# EAGLE design pwm-driver (EAGLE 4.16)
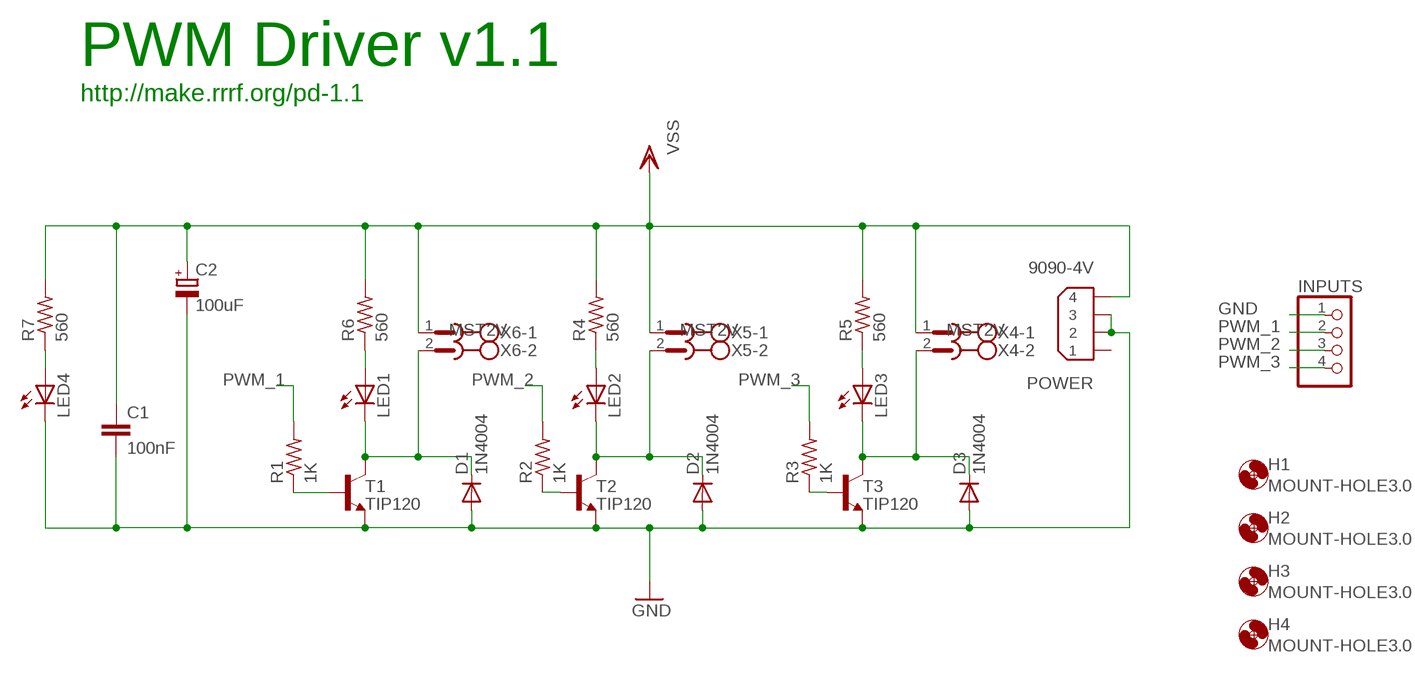
[diagram p0: schematic, sheet 1]

## Parts
C1  100nF  C-EU050-045X075  [C050-045X075]
C2  100uF  CPOL-EUE3.5-8  [E3,5-8]
D1  1N4004  [DO41-10]
D2  1N4004  [DO41-10]
D3  1N4004  [DO41-10]
H1  MOUNT-HOLE3.0  [3,0]
H2  MOUNT-HOLE3.0  [3,0]
H3  MOUNT-HOLE3.0  [3,0]
H4  MOUNT-HOLE3.0  [3,0]
INPUTS  PINHD-1X4  [1X04]
LED1  LED5MM  [LED5MM]
LED2  LED5MM  [LED5MM]
LED3  LED5MM  [LED5MM]
LED4  LED5MM  [LED5MM]
POWER  9090-4V  [9090-4V]
R1  1K  R-US_0207/7  [0207/7]
R2  1K  R-US_0207/7  [0207/7]
R3  1K  R-US_0207/7  [0207/7]
R4  560  R-US_0207/7  [0207/7]
R5  560  R-US_0207/7  [0207/7]
R6  560  R-US_0207/7  [0207/7]
R7  560  R-US_0207/7  [0207/7]
T1  TIP120  -NPN-TO220V  [TO220V]
T2  TIP120  -NPN-TO220V  [TO220V]
T3  TIP120  -NPN-TO220V  [TO220V]
X4  MST2V  [MSTBV2]
X5  MST2V  [MSTBV2]
X6  MST2V  [MSTBV2]

## Nets
GND: C1.2 C2.- D1.A D2.A D3.A INPUTS.1 LED4.K(C) POWER.2 POWER.3 T1.3(E) T2.3(E) T3.3(E)
N$1: D1.C LED1.K(C) T1.2(C) X6.2
N$2: D2.C LED2.K(C) T2.2(C) X5.2
N$3: D3.C LED3.K(C) T3.2(C) X4.2
N$4 [signal]: LED3.A R5.1
N$5 [signal]: LED2.A R4.1
N$6: R2.1 T2.1(B)
N$7: R3.1 T3.1(B)
N$8: R1.1 T1.1(B)
N$9 [signal]: LED1.A R6.1
N$10 [signal]: LED4.A R7.1
PWM_1 [signal]: INPUTS.2 R1.2
PWM_2 [signal]: INPUTS.3 R2.2
PWM_3 [signal]: INPUTS.4 R3.2
VSS: C1.1 C2.+ POWER.4 R4.2 R5.2 R6.2 R7.2 X4.1 X5.1 X6.1
Unconnected: POWER.1

## Notes on the sheet
- PWM Driver v1.1
- http://make.rrrf.org/pd-1.1

## Library data of the parts
C1 = rcl:C-EU: CAPACITOR, European symbol
C2 = rcl:CPOL-EU: POLARIZED CAPACITOR, European symbol
D1-D3 = diode:1N4004: DIODE general purpose rectifier, 1 A
H1-H4 = holes:MOUNT-HOLE: MOUNTING HOLE with drill center marker
INPUTS = pinhead:PINHD-1X4: PIN HEADER
LED1-LED4 = led:LED: LED OSRAM: - CHIPLED LG R971, LG N971, LY N971, LG Q971, LY Q971, LO R971, LY R971 LH N974, LH R974 LS Q976, LO Q976, LY Q976 LO Q996 - Hyper CHIPLED LW Q18S LB Q993, LB Q99A, LB R99A - SideLED LS A670, LO A670, LY A670, LG A670, LP A670 LB A673, LV A673, LT A673, LW A673 LH A674 LY A675 LS A676, LA A676, LO A676, LY A676, LW A676 LS A679, LY A679, LG A679 - Hyper Micro SIDELED® LS Y876, LA Y876, LO Y876, LY Y876 LT Y87S - SmartLED LW L88C, LW L88S LB L89C, LB L89S, LG L890 LS L89K, LO L89K, LY L89K LS L896, LA L896, LO L896, LY L896 - TOPLED LS T670, LO T670, LY T670, LG T670, LP T670 LSG T670, LSP T670, LSY T670, LOP T670, LYG T670 LG T671, LOG T671, LSG T671 LB T673, LV T673, LT T673, LW T673 LH T674 LS T676, LA T676, LO T676, LY T676, LB T676, LH T676, LSB T676, LW T676 LB T67C, LV T67C, LT T67C, LS T67K, LO T67K, LY T67K, LW E67C LS E67B, LA E67B, LO E67B, LY E67B, LB E67C, LV E67C, LT E67C LW T67C LS T679, LY T679, LG T679 LS T770, LO T770, LY T770, LG T770, LP T770 LB T773, LV T773, LT T773, LW T773 LH T774 LS E675, LA E675, LY E675, LS T675 LS T776, LA T776, LO T776, LY T776, LB T776 LHGB T686 LT T68C, LB T68C - Hyper Mini TOPLED® LB M676 - Mini TOPLED Santana® LG M470 LS M47K, LO M47K, LY M47K Source: http://www.osram.convergy.de - LUMILED® LXK2-PW12-R00, LXK2-PW12-S00, LXK2-PW14-U00, LXK2-PW14-V00 LXK2-PM12-R00, LXK2-PM12-S00, LXK2-PM14-U00 LXK2-PE12-Q00, LXK2-PE12-R00, LXK2-PE12-S00, LXK2-PE14-T00, LXK2-PE14-U00 LXK2-PB12-K00, LXK2-PB12-L00, LXK2-PB12-M00, LXK2-PB14-N00, LXK2-PB14-P00, LXK2-PB14-Q00 LXK2-PR12-L00, LXK2-PR12-M00, LXK2-PR14-Q00, LXK2-PR14-R00 LXK2-PD12-Q00, LXK2-PD12-R00, LXK2-PD12-S00 LXK2-PH12-R00, LXK2-PH12-S00 LXK2-PL12-P00, LXK2-PL12-Q00, LXK2-PL12-R00 Source: www.luxeon.com
POWER = con-thomas-betts:9090-4: Disk Drive Power four position Source: Thomas & Betts Electronic Interconnects Eiropean Edition 1998
R1-R7 = rcl:R-US_: RESISTOR, American symbol
T1-T3 = transistor:*-NPN-: NPN Transistror
X4-X6 = con-phoenix-508:MST2V: PHOENIX

## Net classes
0 default: width 1.27 mm, drill 0.406 mm
1 signal: width 0.508 mm, drill 0.406 mm

## Board
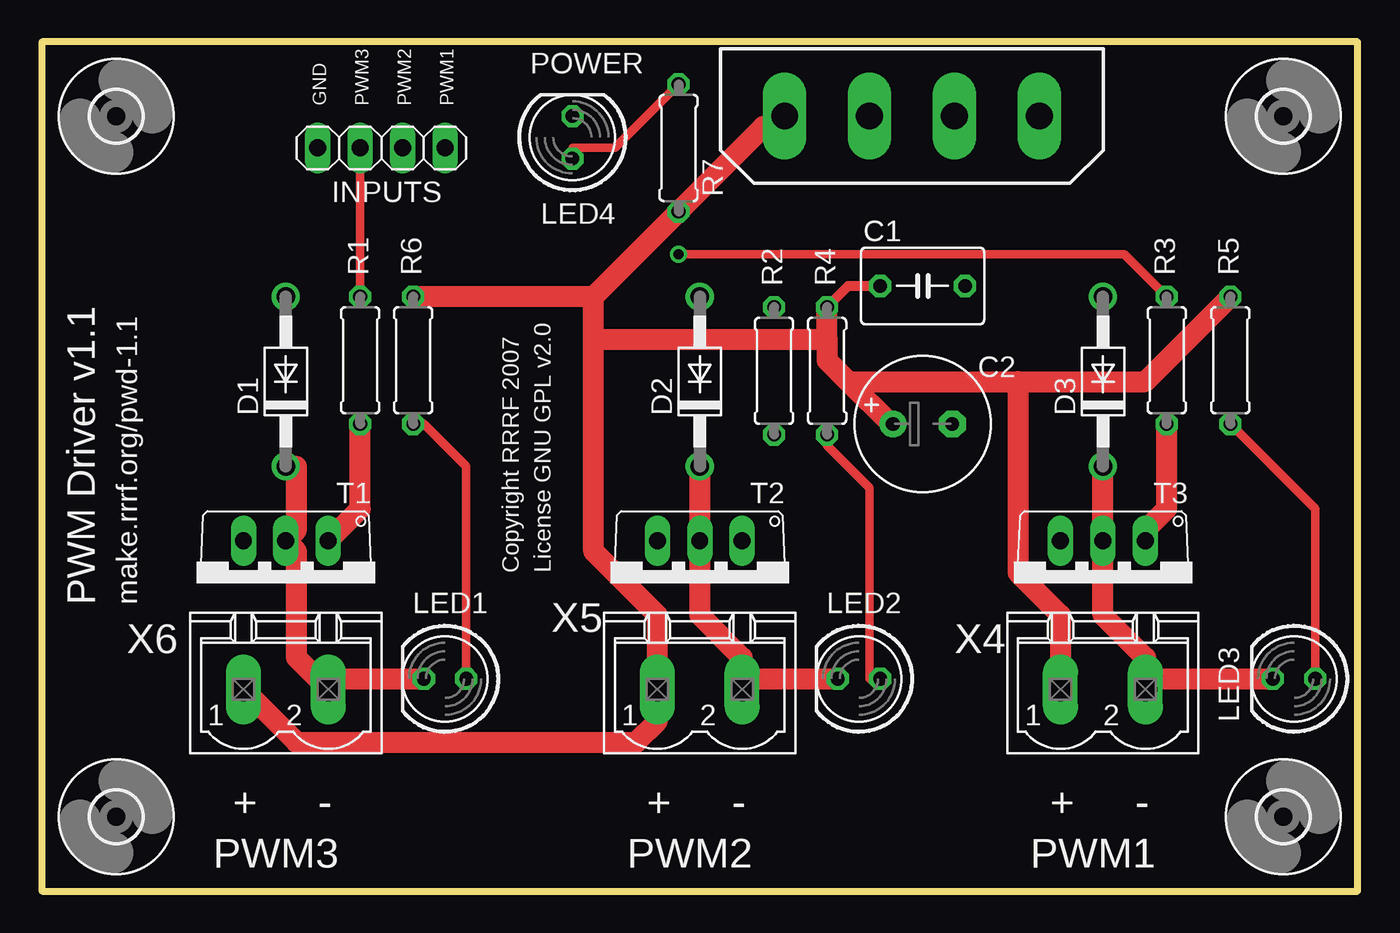
[diagram p1: board, top side]
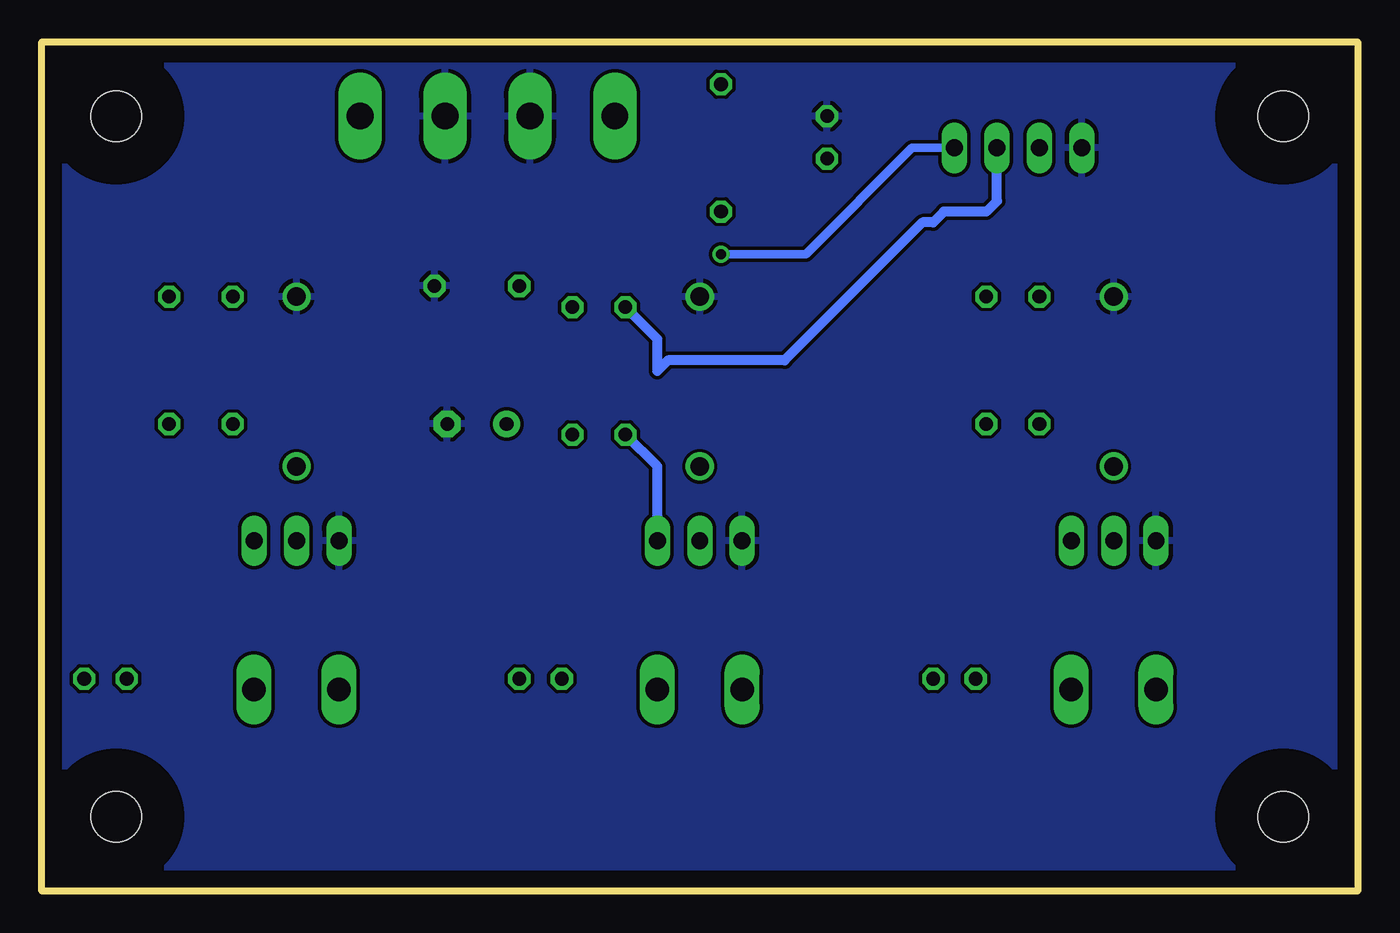
[diagram p2: board, bottom side, seen from below]

Size 78.74 x 50.8 mm. Coordinates in mm from the lower left corner, seen from the top.
Outline: 78.74,0 78.74,50.8 0,50.8 0,0 78.74,0
Copper layers (1*16): Top 0.035mm / dielectric 1.5mm / Bottom 0.035mm
Design rules "default": minimum track width 10mil, minimum drill 24mil, track to track 8mil, track to pad 8mil, pad to pad 8mil, via to via 8mil, smd to smd 8mil, copper to edge 40mil, drill to drill 8mil, minimum pad ring 10mil, minimum via ring 8mil, stop-mask expansion 4mil, vias tented up to drill 0mil, thermal gap 10mil

### Footprints (pad centres in the part's own frame; a part is rotated, then mirrored left to right if it is on the bottom)
C050-045X075 = drill 0.813 octagon: 1 -2.54,0; 2 2.54,0
E3,5-8 = drill 0.813 pad 1.6 round: + -1.778,0 | drill 0.813 pad 1.6 octagon: - 1.778,0
DO41-10 = drill 1.118 round: A 5.08,0; C -5.08,0
3,0 = hole 3: 0,0
1X04 = drill 1.016 long: 1 -3.81,0; 2 -1.27,0; 3 1.27,0; 4 3.81,0
LED5MM = drill 0.813 octagon: A -1.27,0; K 1.27,0
9090-4V = drill 1.6 pad 2.6 long: 1 -7.62,0; 2 -2.54,0; 3 2.54,0; 4 7.62,0
0207/7 = drill 0.813 octagon: 1 -3.81,0; 2 3.81,0
TO220V = drill 1.016 long: 1 -2.54,-2.54; 2 0,-2.54; 3 2.54,-2.54
MSTBV2 = drill 1.397 long: 1 -2.54,0; 2 2.54,0

### Placement (x,y rotation side)
C1  52.71,36.2 0 top
C2  52.71,27.94 0 top
D1  14.61,30.48 90 top
D2  39.37,30.48 90 top
D3  63.5,30.48 90 top
H1  74.3,46.36 0 top
H2  4.44,46.36 0 top
H3  4.44,4.44 0 top
H4  74.3,4.44 0 top
INPUTS  20.32,44.45 0 top
LED1  24.13,12.7 180 top
LED2  48.9,12.7 180 top
LED3  74.93,12.7 180 top
LED4  31.75,45.09 90 top
POWER  52.07,46.36 180 top
R1  19.05,31.75 90 top
R2  43.82,31.11 90 top
R3  67.31,31.75 90 top
R4  46.99,31.11 90 top
R5  71.12,31.75 90 top
R6  22.22,31.75 90 top
R7  38.1,44.45 270 top
T1  14.61,18.41 180 top
T2  39.37,18.41 180 top
T3  63.5,18.41 180 top
X4  63.5,12.07 0 top
X5  39.37,12.07 0 top
X6  14.61,12.07 0 top

### Tracks (layer width: path | path; a pad name or v marks a point on that pad's centre or on a via)
GND
  pour Bottom: 0,50.8 78.74,50.8 78.74,0 0,0
N$1
  Top 1.27: D1.C 15.24,25.4 15.24,21.59 T1.2 15.24,20.32 15.24,13.97 X6.2 17.78,12.7 LED1.K
N$2
  Top 1.27: D2.C T2.2 39.37,16.51 41.91,13.97 X5.2 41.91,12.7 LED2.K
N$3
  Top 1.27: D3.C T3.2 63.5,16.51 66.04,13.97 X4.2 66.04,12.7 LED3.K
N$4
  Top 0.508: LED3.A 76.2,22.86 R5.1
N$5
  Top 0.508: LED2.A 49.53,12.7 49.53,24.13 46.99,26.67 R4.1
N$6
  Bottom 0.61: R2.1 41.91,25.4 T2.1
N$7
  Top 1.27: R3.1 67.31,22.86 66.04,21.59 T3.1
N$8
  Top 1.27: R1.1 19.05,22.86 T1.1
N$9
  Top 0.508: LED1.A 25.4,25.4 22.86,27.94 R6.1
N$10
  Top 0.508: R7.1 34.29,44.45 31.75,44.45 LED4.A
PWM_1
  Top 0.508: R1.2 INPUTS.2
PWM_2
  Bottom 0.61: R2.2 41.91,33.02 41.91,31.11 41.28,31.75 34.29,31.75 26.04,40 25.4,40 24.76,40.64 22.22,40.64 21.59,41.28 INPUTS.3
PWM_3  (via drill 0.61)
  Top 0.508: R3.2 64.77,38.1 v38.1,38.1
  Bottom 0.508: v38.1,38.1 33.02,38.1 26.67,44.45 INPUTS.4
VSS
  Top 0.61: R4.2 48.26,36.2 C1.1
  Top 1.27: 46.99,33.02 46.99,31.75 48.26,30.48 | 48.26,30.48 50.8,27.94 C2.+ | 46.99,33.02 R4.2 | R5.2 66.04,30.48 58.42,30.48 | 48.26,30.48 58.42,30.48 | 58.42,30.48 58.42,19.05 60.96,16.51 X4.1 | X6.1 15.24,8.89 35.56,8.89 36.83,10.16 X5.1 36.83,16.51 33.02,20.32 33.02,33.02 | 33.02,35.56 R7.2 43.18,45.72 POWER.4 | 33.02,35.56 R6.2 | 33.02,33.02 33.02,35.56 | 33.02,33.02 46.99,33.02

### Text on the board
tPlace: GND | PWM3 | PWM2 | PWM1 | Copyright RRRF 2007 | License GNU GPL v2.0 | PWM Driver v1.1 | make.rrrf.org/pwd-1.1 | + | - | + | - | + | - | PWM3 | PWM2 | PWM1